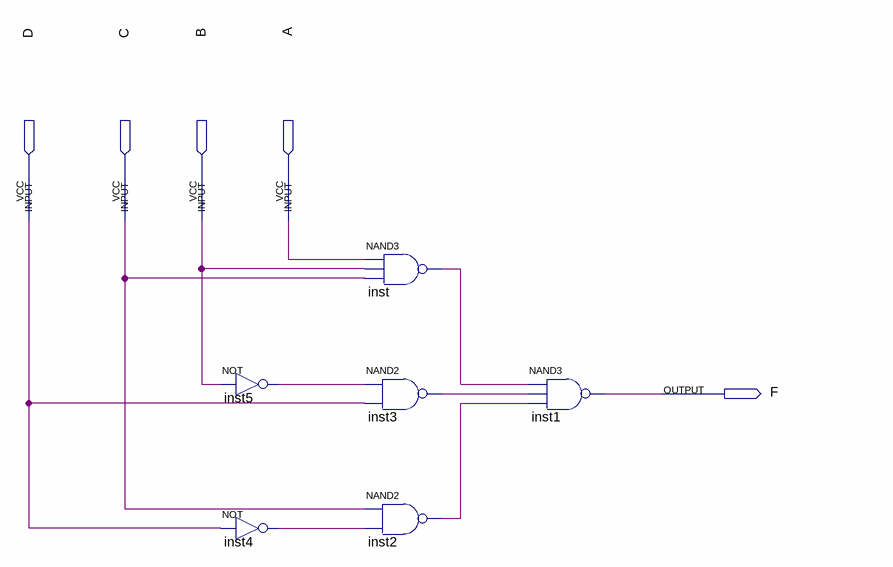
[diagram p0: schematic sheet]
// Quartus schematic dMogan_Bool_2.bdf as structural Verilog: 6 symbols, 5 pins
module dMogan_Bool_2 (
  input  D,
  input  C,
  input  B,
  input  A,
  output F
);

  wire inst2_out, inst3_out, inst4_out, inst5_out, inst_out;

  not inst5 (inst5_out, B);
  not inst4 (inst4_out, D);
  nand inst (inst_out, A, B, C);
  nand inst3 (inst3_out, inst5_out, D);
  nand inst2 (inst2_out, C, inst4_out);
  nand inst1 (F, inst_out, inst3_out, inst2_out);
endmodule
